# Altium project 核心板.PrjPcb
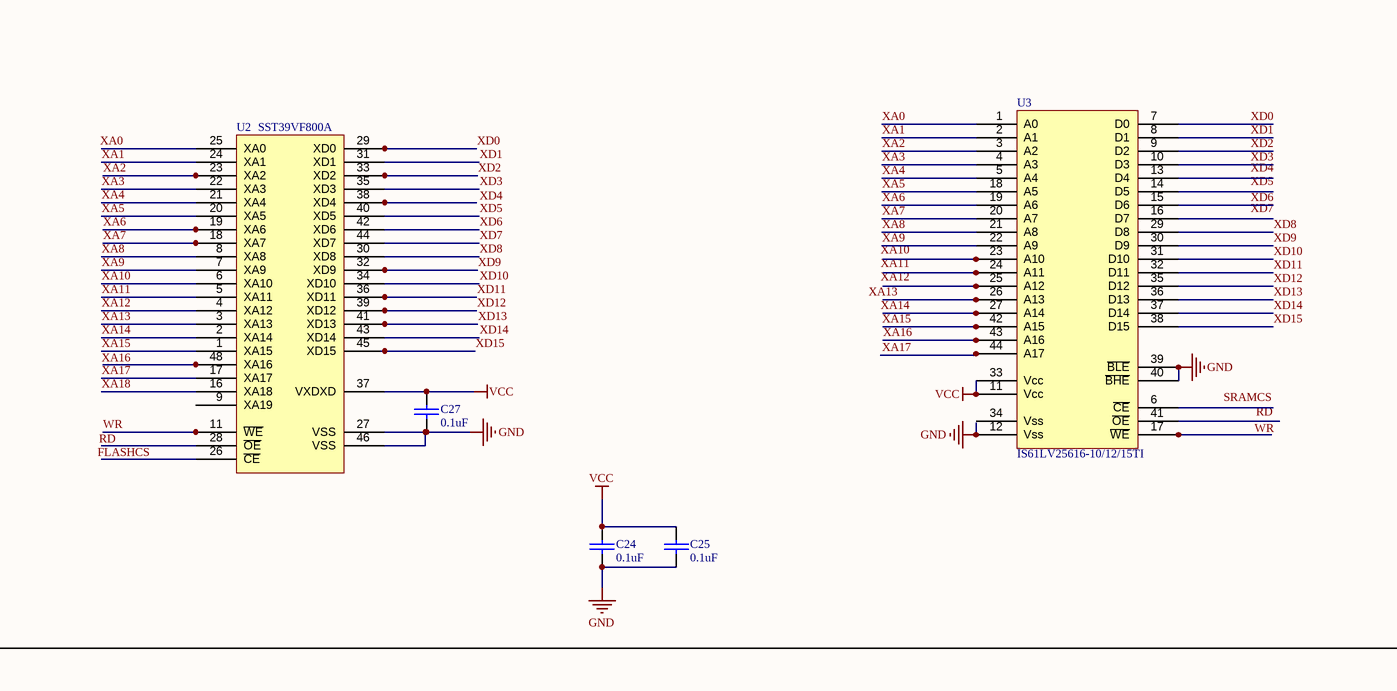
[diagram p0: 核心板原理图.SchDoc, top left]
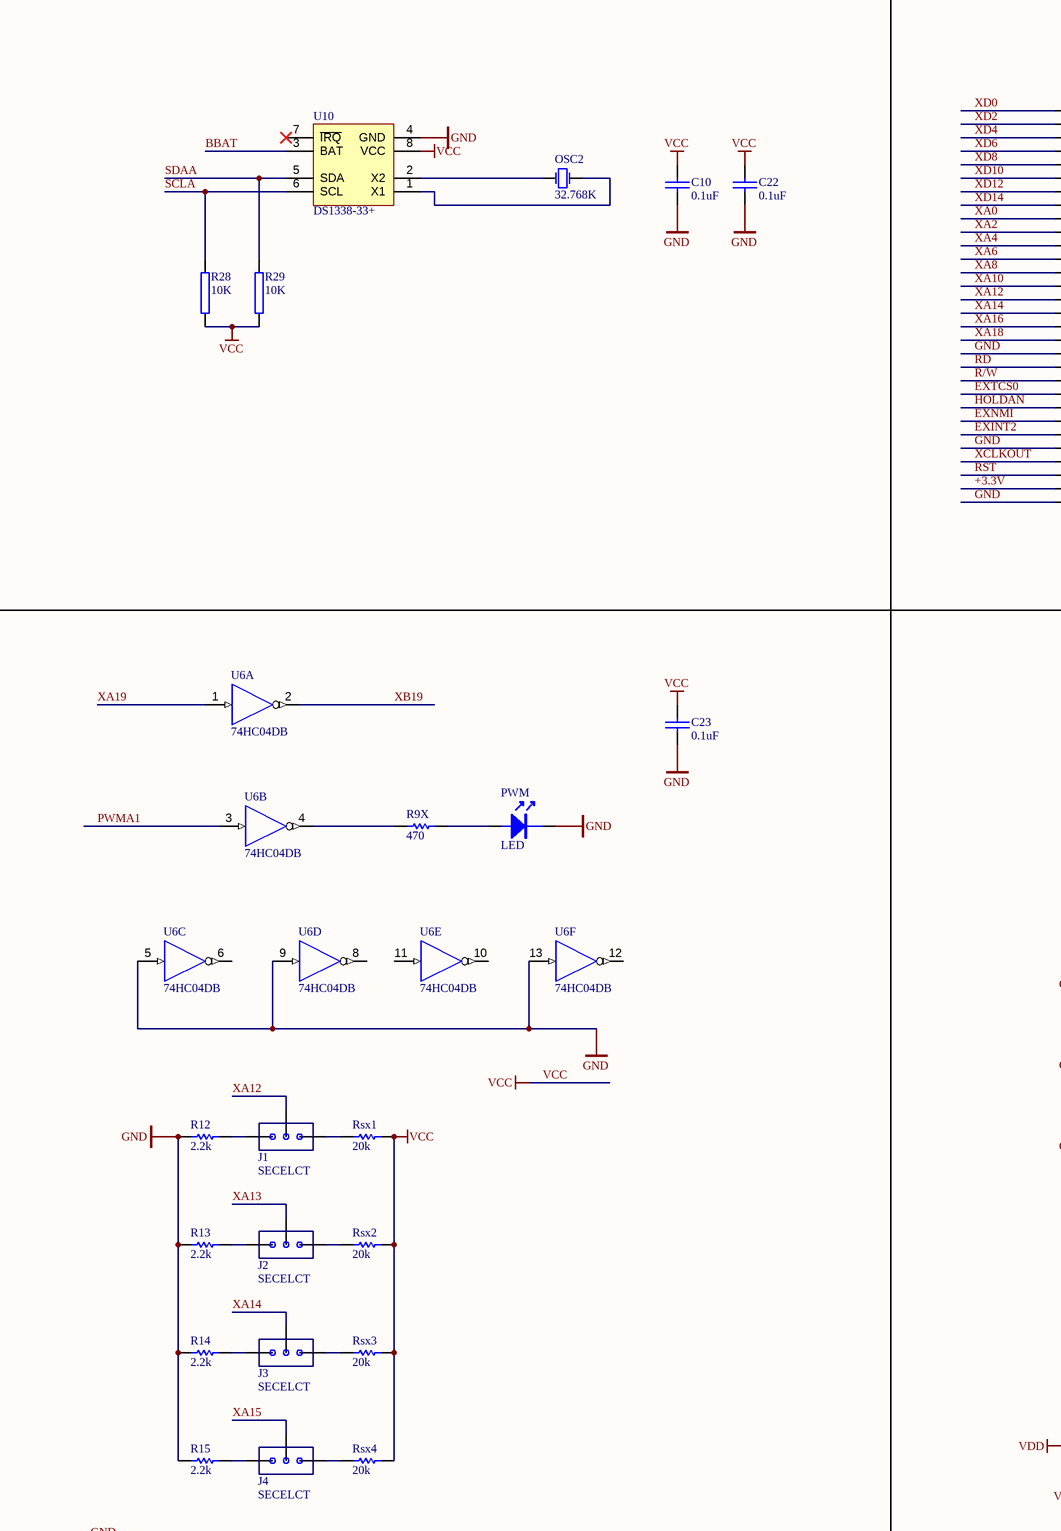
[diagram p1: 核心板原理图.SchDoc, top middle]
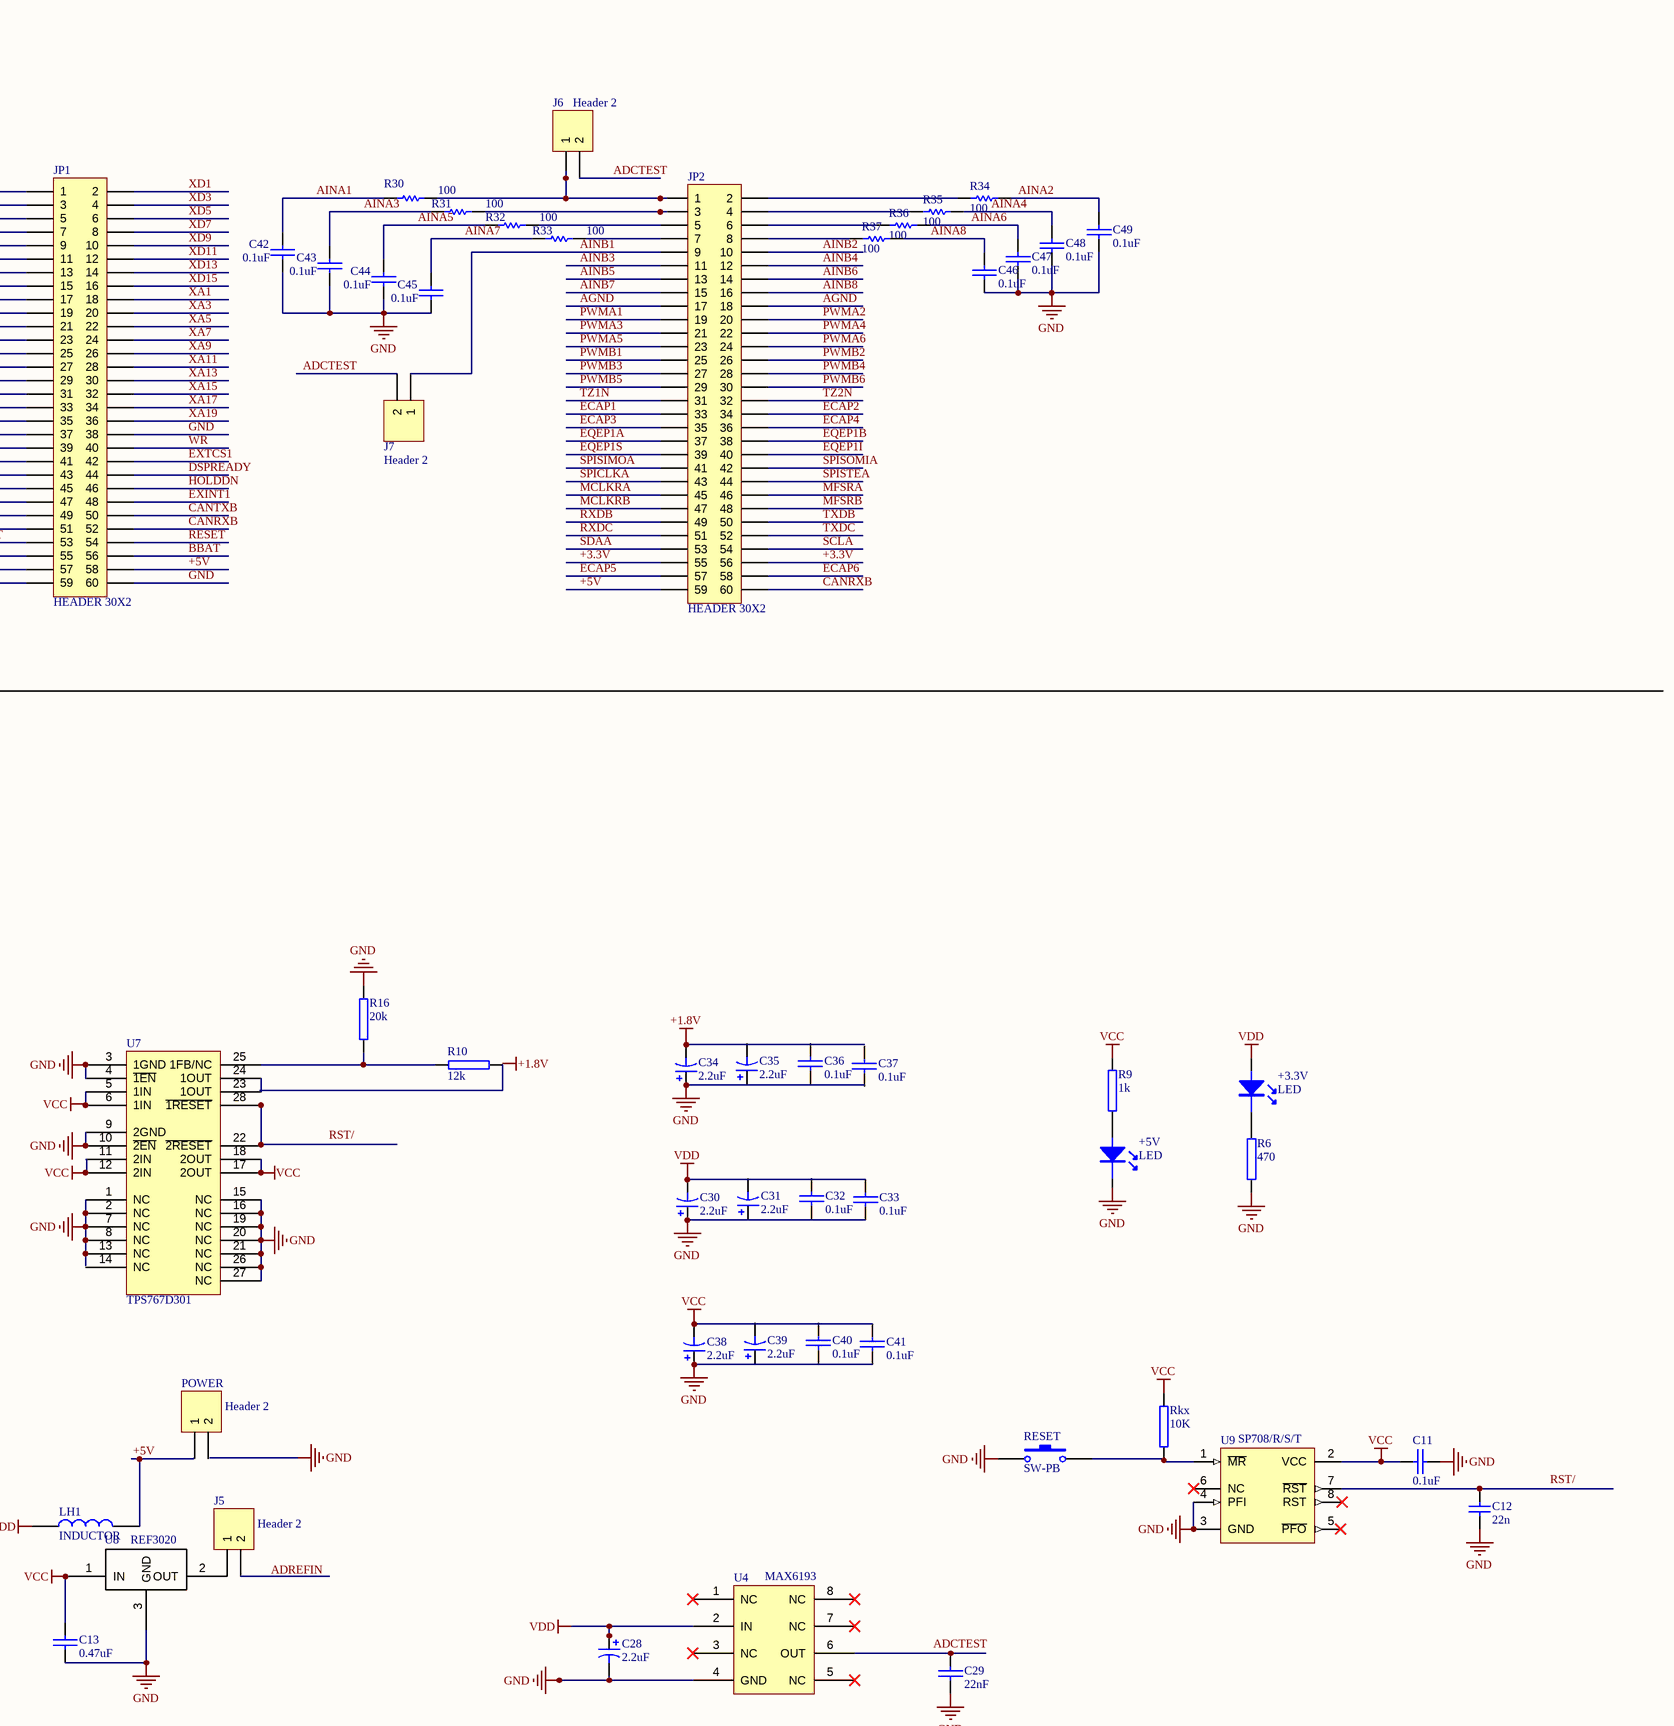
[diagram p2: 核心板原理图.SchDoc, top right]
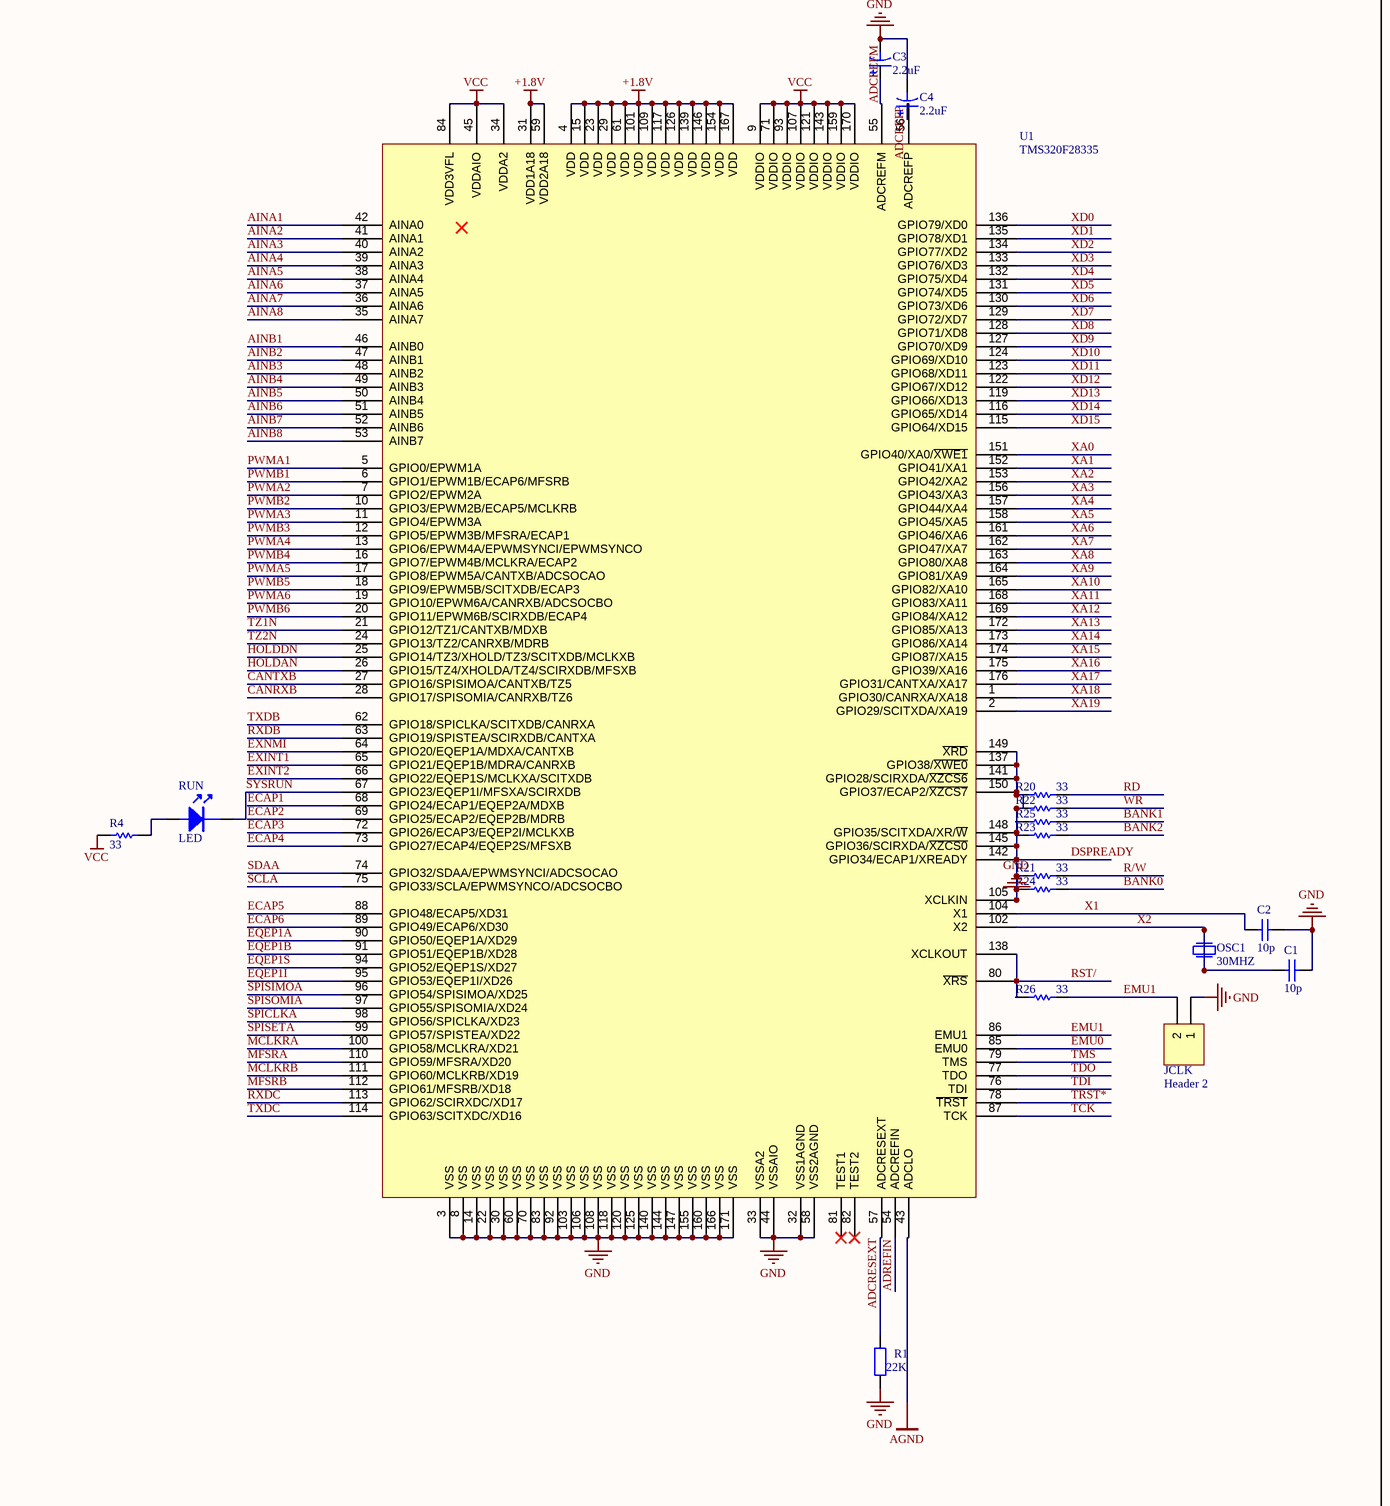
[diagram p3: 核心板原理图.SchDoc, bottom left]
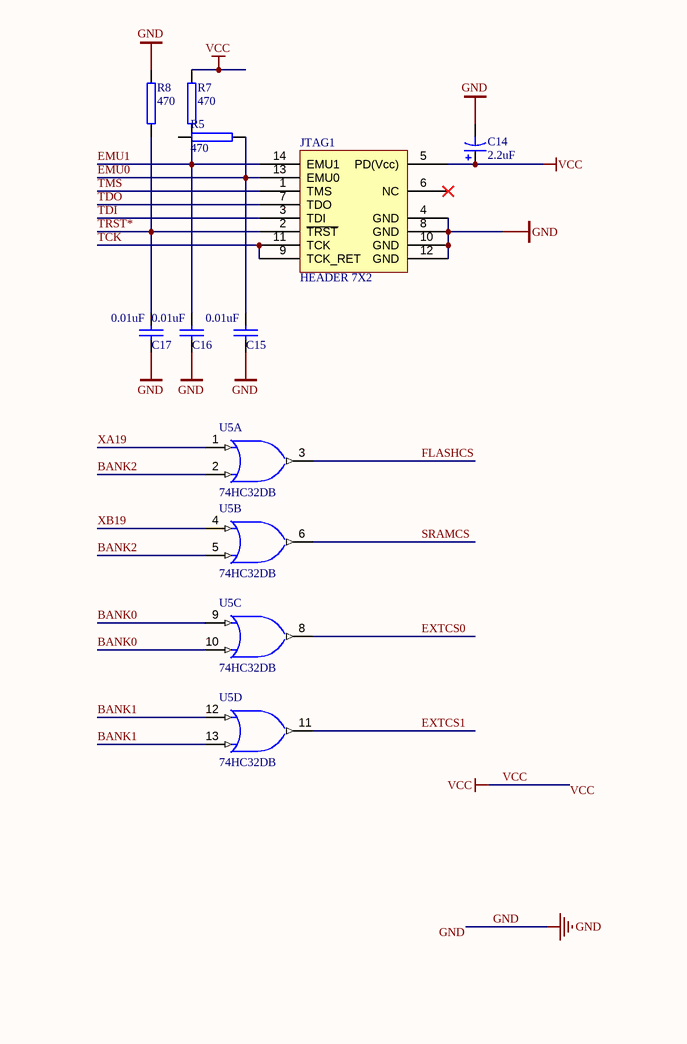
[diagram p4: 核心板原理图.SchDoc, bottom middle]
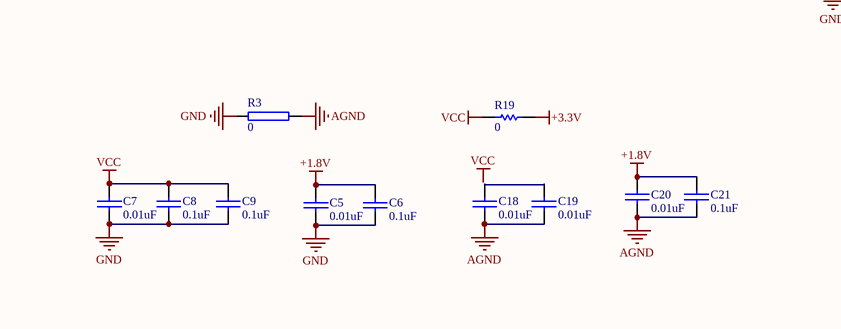
[diagram p5: 核心板原理图.SchDoc, bottom right]
1 sheet, 116 parts. Net scope: global (net labels, ports and power ports of the same name join across sheets).
Board file: 新核心板PCB.PcbDoc

## Sheet 核心板原理图.SchDoc
size OrCAD D; SheetNumber: 1; SheetTotal: 1

### Parts
+3.3V  LED  [1N60P]
+5V  LED  [1N60P]
C1  value 10p  [C0603L]  (hidden comment: C10p-0603)
C2  value 10p  [C0603L]  (hidden comment: C10p-0603)
C3  2.2uF  [0805]
C4  2.2uF  [0805]
C5  0.01uF  [0805]
C6  0.1uF  [0805]
C7  0.01uF  [0805]
C8  0.1uF  [0805]
C9  0.1uF  [0805]
C10  0.1uF  [0805]
C11  0.1uF  [0805]
C12  value 22n  [C0603L]  (hidden comment: C22n-0603)
C13  0.47uF  [0805]
C14  2.2uF  [0805]
C15  0.01uF  [0805]
C16  0.01uF  [0805]
C17  0.01uF  [0805]
C18  0.01uF  [0805]
C19  0.01uF  [0805]
C20  0.01uF  [0805]
C21  0.1uF  [0805]
C22  0.1uF  [0805]
C23  0.1uF  [0805]
C24  0.1uF  [0805]
C25  0.1uF  [0805]
C27  0.1uF  [0805]
C28  2.2uF  [0805]
C29  22nF  [0805]
C30  2.2uF  [0805]
C31  2.2uF  [0805]
C32  0.1uF  [0805]
C33  0.1uF  [0805]
C34  2.2uF  [0805]
C35  2.2uF  [0805]
C36  0.1uF  [0805]
C37  0.1uF  [0805]
C38  2.2uF  [0805]
C39  2.2uF  [0805]
C40  0.1uF  [0805]
C41  0.1uF  [0805]
C42  0.1uF  [0805]
C43  0.1uF  [0805]
C44  0.1uF  [0805]
C45  0.1uF  [0805]
C46  0.1uF  [0805]
C47  0.1uF  [0805]
C48  0.1uF  [0805]
C49  0.1uF  [0805]
J1  SECELCT  [TTIP3]
J2  SECELCT  [TTIP3]
J3  SECELCT  [TTIP3]
J4  SECELCT  [TTIP3]
J5  Header 2  [TTIP2]
J6  Header 2  [TTIP2]
J7  Header 2  [TTIP2]
JCLK  Header 2  [TTIP2]
JP1  HEADER 30X2  [TTIP30X2]
JP2  HEADER 30X2  [TTIP30X2]
JTAG1  HEADER 7X2  [IDC14-A-JATG]
LH1  INDUCTOR  [3216]
OSC1  30MHZ  [XTAL1]
OSC2  value 32.768K  [XTAL-DIP2S3*8]  (hidden comment: CR32K-DT38-12-DIP)
POWER  Header 2  [TTIP2]
PWM  LED  [1N60P]
R1  value 22K  [R0603L]  (hidden comment: R22K-0603)
R3  0  [0805]
R4  value 33  [0805]  (hidden comment: Res1)
R5  470  [0805]
R6  470  [0805]
R7  470  [0805]
R8  470  [0805]
R9  1k  [0805]
R9X  value 470  [0805]  (hidden comment: Res1)
R10  12k  [0805]
R12  value 2.2k  [0805]  (hidden comment: Res1)
R13  value 2.2k  [0805]  (hidden comment: Res1)
R14  value 2.2k  [0805]  (hidden comment: Res1)
R15  value 2.2k  [0805]  (hidden comment: Res1)
R16  20k  [0805]
R19  value 0  [0805]  (hidden comment: Res1)
R20  value 33  [0805]  (hidden comment: Res1)
R21  value 33  [0805]  (hidden comment: Res1)
R22  value 33  [0805]  (hidden comment: Res1)
R23  value 33  [0805]  (hidden comment: Res1)
R24  value 33  [0805]  (hidden comment: Res1)
R25  value 33  [0805]  (hidden comment: Res1)
R26  value 33  [0805]  (hidden comment: Res1)
R28  10K  [0805]
R29  10K  [0805]
R30  value 100  [0805]  (hidden comment: Res1)
R31  value 100  [0805]  (hidden comment: Res1)
R32  value 100  [0805]  (hidden comment: Res1)
R33  value 100  [0805]  (hidden comment: Res1)
R34  value 100  [0805]  (hidden comment: Res1)
R35  value 100  [0805]  (hidden comment: Res1)
R36  value 100  [0805]  (hidden comment: Res1)
R37  value 100  [0805]  (hidden comment: Res1)
RESET  SW-PB  [KEY2]
Rkx  10K  [0805]
Rsx1  value 20k  [0805]  (hidden comment: Res1)
Rsx2  value 20k  [0805]  (hidden comment: Res1)
Rsx3  value 20k  [0805]  (hidden comment: Res1)
Rsx4  value 20k  [0805]  (hidden comment: Res1)
RUN  LED  [1N60P]
U1  TMS320F28335  [LQFP-176]
U2  SST39VF800A  [TSOP48]
U3  IS61LV25616-10/12/15TI  [TSOP II Z44]
U4  MAX6193  [SO-8]
U5  74HC32DB  [SSOP14]  (parts A,B,C,D of 4)
U6  74HC04DB  [SSOP14]  (parts A,B,C,D,E,F of 6)
U7  TPS767D301  [TSOP-28]
U8  REF3020  [X3-1]
U9  SP708/R/S/T  [SOIC-8]
U10  DS1338-33+  [SO-08]

### Nets
+1.8V: C5.1 C6.1 C20.1 C21.1 U1.4(VDD) U1.15(VDD) U1.23(VDD) U1.29(VDD) U1.31(VDD1A18) U1.59(VDD2A18) U1.61(VDD) U1.101(VDD) U1.109(VDD) U1.117(VDD) U1.126(VDD) U1.139(VDD) U1.146(VDD) U1.154(VDD) U1.167(VDD)
+3.3V: JP1.57 JP2.55 JP2.56 R19.2
AGND: C18.2 C19.2 C20.2 C21.2 JP2.17 JP2.18 R3.2 U1.43(ADCLO)
DSPREADY: C1.1 C2.1 C3.2 C4.2 C5.2 C6.2 C7.2 C8.2 C9.2 C10.2 C11.2 C12.1 C13.2 C14.2 C15.2 C16.2 C17.2 C22.2 C23.2 C24.2 C25.2 C27.2 C28.2 C29.2 C30.1 C33.2 C34.1 C38.1 C41.2 C42.2 C43.2 C44.2 C45.2 C46.1 C47.1 C48.1 C49.1 JCLK.1 JP1.37 JP1.38 JP1.44 JP1.51 JP1.59 JP1.60 JTAG1.4(GND) JTAG1.8(GND) JTAG1.10(GND) JTAG1.12(GND) PWM.K R1.2 R6.1 R8.2 R12.1 R13.1 R14.1 R15.1 R16.1 R20.1 R21.1 R22.1 R24.1 RESET.1 U1.3(VSS) U1.8(VSS) U1.14(VSS) U1.22(VSS) U1.30(VSS) U1.32(VSS1AGND) U1.33(VSSA2) U1.44(VSSAIO) U1.58(VSS2AGND) U1.60(VSS) U1.70(VSS) U1.83(VSS) U1.92(VSS) U1.103(VSS) U1.105(XCLKIN) U1.106(VSS) U1.108(VSS) U1.118(VSS) U1.120(VSS) U1.125(VSS) U1.137(GPIO38/~{XWE0}) U1.140(VSS) U1.141(GPIO28/SCIRXDA/~{XZCS6}) U1.142(GPIO34/ECAP1/XREADY) U1.144(VSS) U1.145(GPIO36/SCIRXDA/~{XZCS0}) U1.147(VSS) U1.148(GPIO35/SCITXDA/XR/~{W}) U1.149(~{XRD}) U1.150(GPIO37/ECAP2/~{XZCS7}) U1.155(VSS) U1.160(VSS) U1.166(VSS) U1.171(VSS) U2.27(VSS) U2.46(VSS) U3.12(Vss) U3.39(~{BLE}) U3.40(~{BHE}) U4.4(GND) U6.5(3A) U6.9(4A) U6.13(6A) U7.1(NC) U7.2(NC) U7.3(1GND) U7.4(~{1EN}) U7.7(NC) U7.8(NC) U7.9(2GND) U7.10(~{2EN}) U7.13(NC) U7.15(NC) U7.16(NC) U7.19(NC) U7.20(NC) U7.21(NC) U7.26(NC) U7.27(NC) U8.3(GND) U9.3(GND) U9.4(PFI) U10.4(GND)  [also labelled GND]
VCC: C7.1 C8.1 C9.1 C10.1 C11.1 C13.1 C14.1 C22.1 C23.1 C24.1 C25.1 C27.1 JTAG1.5(PD(Vcc)) R4.1 R7.2 R19.1 R28.1 R29.1 Rkx.1 Rsx1.2 Rsx2.2 Rsx3.2 Rsx4.2 U1.9(VDDIO) U1.34(VDDA2) U1.45(VDDAIO) U1.71(VDDIO) U1.84(VDD3VFL) U1.93(VDDIO) U1.107(VDDIO) U1.121(VDDIO) U1.143(VDDIO) U1.159(VDDIO) U1.170(VDDIO) U2.37(VXDXD) U3.11(Vcc) U3.33(Vcc) U7.11(2IN) U7.12(2IN) U7.17(2OUT) U7.18(2OUT) U8.1(IN) U9.2(VCC) U10.8(VCC)
VDD: +3.3V.A C28.1 LH1.1 U4.2(IN)
+5V: JP1.58 JP2.59 LH1.2
ADCREFM: C3.1 U1.55(ADCREFM)
ADCRESEXT: R1.1 U1.57(ADCRESEXT)
ADCTEST: J6.2 J7.2
ADREFIN: U1.54(ADCREFIN)
AINA1: C42.1 R30.1 U1.42(AINA0)
AINA2: C49.2 R34.1 U1.41(AINA1)
AINA3: C43.1 R31.1 U1.40(AINA2)
AINA4: C48.2 R35.1 U1.39(AINA3)
AINA5: C44.1 R32.1 U1.38(AINA4)
AINA6: C47.2 R36.1 U1.37(AINA5)
AINA7: C45.1 R33.1 U1.36(AINA6)
AINA8: C46.2 R37.1 U1.35(AINA7)
AINB1: J7.1 JP2.9 U1.46(AINB0)
AINB2: JP2.10 U1.47(AINB1)
AINB3: JP2.11 U1.48(AINB2)
AINB4: JP2.12 U1.49(AINB3)
AINB5: JP2.13 U1.50(AINB4)
AINB6: JP2.14 U1.51(AINB5)
AINB7: JP2.15 U1.52(AINB6)
AINB8: JP2.16 U1.53(AINB7)
BANK0: R24.2 U5.9(3A) U5.10(3B)
BANK1: R25.2 U5.12(4A) U5.13(4B)
BANK2: R23.2 U5.2(1B) U5.5(2B)
BBAT: JP1.56 U10.3(BAT)
CANRXB: JP1.52 JP2.60 U1.28(GPIO17/SPISOMIA/CANRXB/TZ6)
CANTXB: JP1.50 U1.27(GPIO16/SPISIMOA/CANTXB/TZ5)
ECAP1: JP2.33 U1.68(GPIO24/ECAP1/EQEP2A/MDXB)
ECAP2: JP2.34 U1.69(GPIO25/ECAP2/EQEP2B/MDRB)
ECAP3: JP2.35 U1.72(GPIO26/ECAP3/EQEP2I/MCLKXB)
ECAP4: JP2.36 U1.73(GPIO27/ECAP4/EQEP2S/MFSXB)
ECAP5: JP2.57 U1.88(GPIO48/ECAP5/XD31)
ECAP6: JP2.58 U1.89(GPIO49/ECAP6/XD30)
EMU0: C15.1 JTAG1.13(EMU0) R5.1 U1.85(EMU0)
EMU1: C16.1 JCLK.2 JTAG1.14(EMU1) R7.1 R26.2 U1.86(EMU1)
EQEP1A: JP2.37 U1.90(GPIO50/EQEP1A/XD29)
EQEP1B: JP2.38 U1.91(GPIO51/EQEP1B/XD28)
EQEP1I: JP2.40 U1.95(GPIO53/EQEP1I/XD26)
EQEP1S: JP2.39 U1.94(GPIO52/EQEP1S/XD27)
EXINT1: JP1.48 U1.65(GPIO21/EQEP1B/MDRA/CANRXB)
EXINT2: JP1.49 U1.66(GPIO22/EQEP1S/MCLKXA/SCITXDB)
EXNMI: JP1.47 U1.64(GPIO20/EQEP1A/MDXA/CANTXB)
EXTCS0: JP1.43 U5.8(3Y)
EXTCS1: JP1.42 U5.11(4Y)
FLASHCS: U5.3(1Y)
HOLDAN: JP1.45 U1.26(GPIO15/TZ4/XHOLDA/TZ4/SCIRXDB/MFSXB)
HOLDDN: JP1.46 U1.25(GPIO14/TZ3/XHOLD/TZ3/SCITXDB/MCLKXB)
MCLKRA: JP2.45 U1.100(GPIO58/MCLKRA/XD21)
MCLKRB: JP2.47 U1.111(GPIO60/MCLKRB/XD19)
MFSRA: JP2.46 U1.110(GPIO59/MFSRA/XD20)
MFSRB: JP2.48 U1.112(GPIO61/MFSRB/XD18)
PWMA1: JP2.19 U1.5(GPIO0/EPWM1A) U6.3(2A)
PWMA2: JP2.20 U1.7(GPIO2/EPWM2A)
PWMA3: JP2.21 U1.11(GPIO4/EPWM3A)
PWMA4: JP2.22 U1.13(GPIO6/EPWM4A/EPWMSYNCI/EPWMSYNCO)
PWMA5: JP2.23 U1.17(GPIO8/EPWM5A/CANTXB/ADCSOCAO)
PWMA6: JP2.24 U1.19(GPIO10/EPWM6A/CANRXB/ADCSOCBO)
PWMB1: JP2.25 U1.6(GPIO1/EPWM1B/ECAP6/MFSRB)
PWMB2: JP2.26 U1.10(GPIO3/EPWM2B/ECAP5/MCLKRB)
PWMB3: JP2.27 U1.12(GPIO5/EPWM3B/MFSRA/ECAP1)
PWMB4: JP2.28 U1.16(GPIO7/EPWM4B/MCLKRA/ECAP2)
PWMB5: JP2.29 U1.18(GPIO9/EPWM5B/SCITXDB/ECAP3)
PWMB6: JP2.30 U1.20(GPIO11/EPWM6B/SCIRXDB/ECAP4)
R/W: JP1.41 R21.2
RD: JP1.39 R20.2
RESET: JP1.54
RST: JP1.55
RST/: R26.1 U1.80(~{XRS}) U1.138(XCLKOUT)
RXDB: JP2.49 U1.63(GPIO19/SPISTEA/SCIRXDB/CANTXA)
RXDC: JP2.51 U1.113(GPIO62/SCIRXDC/XD17)
SCLA: JP2.54 R28.2 U1.75(GPIO33/SCLA/EPWMSYNCO/ADCSOCBO) U10.6(SCL)
SDAA: JP2.53 R29.2 U1.74(GPIO32/SDAA/EPWMSYNCI/ADCSOCAO) U10.5(SDA)
SPICLKA: JP2.43 U1.98(GPIO56/SPICLKA/XD23)
SPISETA: U1.99(GPIO57/SPISTEA/XD22)
SPISIMOA: JP2.41 U1.96(GPIO54/SPISIMOA/XD25)
SPISOMIA: JP2.42 U1.97(GPIO55/SPISOMIA/XD24)
SPISTEA: JP2.44
SRAMCS: U5.6(2Y)
SYSRUN: RUN.K U1.67(GPIO23/EQEP1I/MFSXA/SCIRXDB)
TCK: JTAG1.9(TCK_RET) JTAG1.11(TCK) U1.87(TCK)
TDI: JTAG1.3(TDI) U1.76(TDI)
TDO: JTAG1.7(TDO) U1.77(TDO)
TMS: JTAG1.1(TMS) U1.79(TMS)
TRST*: C17.1 JTAG1.2(~{TRST}) R8.1 U1.78(~{TRST})
TXDB: JP2.50 U1.62(GPIO18/SPICLKA/SCITXDB/CANRXA)
TXDC: JP2.52 U1.114(GPIO63/SCITXDC/XD16)
TZ1N: JP2.31 U1.21(GPIO12/TZ1/CANTXB/MDXB)
TZ2N: JP2.32 U1.24(GPIO13/TZ2/CANRXB/MDRB)
WR: JP1.40 R22.2 U2.11(~{WE})
X1: C2.2 U1.104(X1)
X2: C1.2 OSC1.1(P1) OSC1.2(P2) U1.102(X2)
XA0: JP1.17 U1.151(GPIO40/XA0/~{XWE1}) U3.1(A0)
XA1: JP1.18 U1.152(GPIO41/XA1) U2.24(XA1) U3.2(A1)
XA2: JP1.19 U1.153(GPIO42/XA2) U2.23(XA2) U3.3(A2)
XA3: JP1.20 U1.156(GPIO43/XA3) U2.22(XA3) U3.4(A3)
XA4: JP1.21 U1.157(GPIO44/XA4) U2.21(XA4) U3.5(A4)
XA5: JP1.22 U1.158(GPIO45/XA5) U2.20(XA5) U3.18(A5)
XA6: JP1.23 U1.161(GPIO46/XA6) U2.19(XA6) U3.19(A6)
XA7: JP1.24 U1.162(GPIO47/XA7) U2.18(XA7) U3.20(A7)
XA8: JP1.25 U1.163(GPIO80/XA8) U2.8(XA8) U3.21(A8)
XA9: JP1.26 U1.164(GPIO81/XA9) U2.7(XA9) U3.22(A9)
XA10: JP1.27 U1.165(GPIO82/XA10) U2.6(XA10)
XA11: JP1.28 U1.168(GPIO83/XA11) U2.5(XA11)
XA12: J1.2 JP1.29 U1.169(GPIO84/XA12) U2.4(XA12)
XA13: J2.2 JP1.30 U1.172(GPIO85/XA13) U2.3(XA13)
XA14: J3.2 JP1.31 U1.173(GPIO86/XA14) U2.2(XA14)
XA15: J4.2 JP1.32 U1.174(GPIO87/XA15) U2.1(XA15)
XA16: JP1.33 U1.175(GPIO39/XA16) U3.43(A16)
XA17: JP1.34 U1.176(GPIO31/CANTXA/XA17) U2.17(XA17) U3.44(A17)
XA18: JP1.35 U1.1(GPIO30/CANRXA/XA18) U2.16(XA18)
XA19: JP1.36 U1.2(GPIO29/SCITXDA/XA19) U5.1(1A) U6.1(1A)
XB19: U5.4(2A) U6.2(1~{Y})
XCLKOUT: JP1.53
XD0: JP1.1 U1.136(GPIO79/XD0) U2.29(XD0) U3.7(D0)
XD1: JP1.2 U1.135(GPIO78/XD1) U2.31(XD1) U3.8(D1)
XD2: JP1.3 U1.134(GPIO77/XD2) U2.33(XD2) U3.9(D2)
XD3: JP1.4 U1.133(GPIO76/XD3) U2.35(XD3) U3.10(D3)
XD4: JP1.5 U1.132(GPIO75/XD4)
XD5: JP1.6 U1.131(GPIO74/XD5) U2.40(XD5)
XD6: JP1.7 U1.130(GPIO73/XD6) U2.42(XD6) U3.15(D6)
XD7: JP1.8 U1.129(GPIO72/XD7) U2.44(XD7)
XD8: JP1.9 U1.128(GPIO71/XD8) U2.30(XD8) U3.29(D8)
XD9: JP1.10 U1.127(GPIO70/XD9) U2.32(XD9) U3.30(D9)
XD10: JP1.11 U1.124(GPIO69/XD10) U2.34(XD10) U3.31(D10)
XD11: JP1.12 U1.123(GPIO68/XD11) U2.36(XD11) U3.32(D11)
XD12: JP1.13 U1.122(GPIO67/XD12) U2.39(XD12) U3.35(D12)
XD13: JP1.14 U1.119(GPIO66/XD13) U2.41(XD13) U3.36(D13)
XD14: JP1.15 U1.116(GPIO65/XD14) U2.43(XD14) U3.37(D14)
XD15: JP1.16 U1.115(GPIO64/XD15) U2.45(XD15) U3.38(D15)
Net+3.3V_K: +3.3V.K R6.2
Net+5V_A: +5V.A R9.2
NetC4_1: C4.1 U1.56(ADCREFP)
NetC12_2: C12.2 U9.7(~{RST})
NetC18_1: C18.1 C19.1
NetC29_1: C29.1 U4.6(OUT)
NetC30_2: C30.2 C33.1
NetC38_2: C38.2 C41.1
NetJ1_1: J1.1 R12.2
NetJ1_3: J1.3 Rsx1.1
NetJ2_1: J2.1 R13.2
NetJ2_3: J2.3 Rsx2.1
NetJ3_1: J3.1 R14.2
NetJ3_3: J3.3 Rsx3.1
NetJ4_1: J4.1 R15.2
NetJ4_3: J4.3 Rsx4.1
NetJ5_1: J5.1 U8.2(OUT)
NetJ6_1: J6.1 JP2.1 R30.2
NetJP2_2: JP2.2 R34.2
NetJP2_3: JP2.3 R31.2
NetJP2_4: JP2.4 R35.2
NetJP2_5: JP2.5 R32.2
NetJP2_6: JP2.6 R36.2
NetJP2_7: JP2.7 R33.2
NetJP2_8: JP2.8 R37.2
NetOSC2_1: OSC2.1(OSC1) U10.2(X2)
NetOSC2_2: OSC2.2(OSC2) U10.1(X1)
NetPWM_A: PWM.A R9X.2
NetR4_2: R4.2 RUN.A
NetR9X_1: R9X.1 U6.4(2~{Y})
NetR10_2: R10.2 R16.2 U7.25(1FB/NC)
NetRESET_2: RESET.2 Rkx.2 U9.1(~{MR})
NetU7_5: U7.5(1IN) U7.6(1IN)
NetU7_22: U7.22(~{2RESET}) U7.28(~{1RESET})
NetU7_23: U7.23(1OUT) U7.24(1OUT)

Not connected (* = marked no-connect by the designer): +5V K; C31 1 2; C32 1 2; C34 2; C35 1 2; C36 1 2; C37 1 2; C39 1 2; C40 1 2; J5 2; JTAG1 6(NC)*; POWER 1 2; R3 1; R5 2; R9 1; R10 1; R23 1; R25 1; U1 81(TEST1)* 82(TEST2)*; U2 9(XA19) 25(XA0) 26(~{CE}) 28(~{OE}) 38(XD4) 48(XA16); U3 6(~{CE}) 13(D4) 14(D5) 16(D7) 17(~{WE}) 23(A10) 24(A11) 25(A12) 26(A13) 27(A14) 34(Vss) 41(~{OE}) 42(A15); U4 1(NC)* 3(NC)* 5(NC)* 7(NC)* 8(NC)*; U5 7(GND) 14(VCC); U6 6(3~{Y}) 7(GND) 8(4~{Y}) 10(5~{Y}) 11(5A) 12(6~{Y}) 14(VCC); U7 14(NC); U9 5(~{PFO}) 6(NC)* 8(RST)*; U10 7(~{IRQ})*

### Notes on the sheet
- Labels drawn without touching a wire or pin: +1.8V, ADCREFP, ADCTEST, ADREFIN, FLASHCS, GND, RD, RST/, SRAMCS, VCC, VDD, WR, XA0, XA10, XA11, XA12, XA13, XA14, XA15, XA16, XD4, XD5, XD7
- DWG NO:
- REV:
- THIS DOCUMENT AND THE DATA DISCLOSED HEREIN OR
- HEREWITH IS THE PROPERTY OF ALTIUM LIMITED AND MAY
- BE FREELY DISTRIBUTED IN WHOLE. NO RIGHTS ARE
- RESERVED OR EXPRESS OR IMPLIED WARANTEE GIVEN.
- REVISION
- DESCRIPTION
- DATE
- APPROVED
- ENG:
- APPROVALS
- PROJECT
- DSN:
- CHK:
- REFERENCE DOCUMENTS
- PROJECT REVISION:
- TITLE
- DOCUMENT REVISION:
- DESIGN ITEM:
- BOM:
- FAB DWG:
- PCB DWG:
- ASSY DWG:
- SCALE:
- A2
- SIZE
- CAGE CODE
- FILE NAME
- DWG NO.
- SHEET
- OF
- REV

### Library data of the parts
C1 C2 = C10p-0603: Pb-free,0603,10pF,NPO,±5%,50V,-55℃～125℃,N（三层电镀端头）,带装; Part Number: 3DZ0040010; specification: Pb-free,0603,10pF,NPO,±5%,50V,-55℃～125℃,N（三层电镀端头）,带装
C3 C4 C14 C28 C30 C31 C34 C35 C38 C39 = Cap Pol3: Polarized Capacitor (Surface Mount); Value: 0.1uF/50V/X7R; Published: 8-Jun-2000; LatestRevisionDate: 29-May-2009; LatestRevisionNote: IPC-7351 Footprint Added.; PackageReference: C0805; Publisher: Altium Limited; PackageDescription: Chip Capacitor
C5-C11 C13 C18-C25 C27 C29 C32 C33 C36 C37 C40-C49 = CAP: Capacitor
C12 = C22n-0603: Pb-free,0603,22nF,X7R,±10%,50V,-55℃～125℃,N（三层电镀端头）,带装; Part Number: 3DZ0040018; specification: Pb-free,0603,22nF,X7R,±10%,50V,-55℃～125℃,N（三层电镀端头）,带装
C15-C17 = C
J5-J7 JCLK POWER = Header 2: Header, 2-Pin; LatestRevisionDate: 17-Jul-2002; LatestRevisionNote: Re-released for DXP Platform.; Publisher: Altium Limited
JP1 JP2 = Header 30X2: Header, 30-Pin, Dual row; LatestRevisionDate: 17-Jul-2002; LatestRevisionNote: Re-released for DXP Platform.; Publisher: Altium Limited
JTAG1 = JTAG-1
OSC1 = 30MHZ: Crystal Oscillator
OSC2 = CR32K-DT38-12-DIP: Pb-free,直插晶体谐振器,DT38G-C12Q-32.768KHz,32.768KHz,12.5pF,±20ppm,DT38（3*8mm）,-40°C~+85°C; Part Number: 3DZ0070001; Specification: Pb-free,直插晶体谐振器,DT38G-C12Q-32.768KHz,32.768KHz,12.5pF,±20ppm,DT38（3*8mm）,-40°C~+85°C
R1 = R22K-0603: Pb-free,0603,22kΩ,1%,1/16w,±200PPM,50V,-55℃～155℃; Part Number: 3DZ0030038; specification: Pb-free,0603,22kΩ,1%,1/16w,±200PPM,50V,-55℃～155℃
R3 R5-R10 R16 R28 R29 Rkx = R
R4 R9X R12-R15 R19-R26 R30-R37 Rsx1-Rsx4 = Res1: Resistor; Published: 8-Jun-2000; LatestRevisionDate: 17-Jul-2002; LatestRevisionNote: Re-released for DXP Platform.; PackageReference: AXIAL-0.3; Publisher: Altium Limited
RESET = SW-PB: Switch; Published: 24-Mar-1999; LatestRevisionDate: 17-Jul-2002; LatestRevisionNote: Re-released for DXP Platform.; PackageReference: SPST-2; Publisher: Altium Limited
U2 = SST39VF800
U3 = CY7C1041
U5 = HD74HC32FP: Quad 2-Input OR Gates; Published: 10-Feb-2010; DatasheetVersion: Rev.2.00, Oct-2005; PackageVersion: Sep-2005; PackageReference: PRSP0014DF-B; Publisher: Altium Limited; PackageDescription: 14-Pin Plastic Small Outline Package, 10.06 x 5.5 mm Body, 1.27 mm Pitch; Code_JEITA: P-SOP14-5.5x10.06-1.27; ComponentLink1Description: Manufacturer Link; ComponentLink1URL: http://sg.renesas.com/fmwk.jsp?cnt=hd74hc_root.jsp&fp=/products/standard_ic/general_purpose_logic/5v_standard_logic/hd74hc/; ComponentLink2Description: Datasheet; ComponentLink2URL: http://documentation.renesas.com/eng/products/logic/rej03d0545_hd74hc32ds.pdf; ComponentLink3Description: Packaging Specification; ComponentLink3URL: http://sg.renesas.com/media/products/common_info/package/pdf/ic/code/prsp0014df_b.pdf
U6 = HD74HC04FP: Hex Inverters; Published: 10-Feb-2010; DatasheetVersion: Rev.2.00, Oct-2005; PackageVersion: Sep-2005; PackageReference: PRSP0014DF-B; Publisher: Altium Limited; PackageDescription: 14-Pin Plastic Small Outline Package, 10.06 x 5.5 mm Body, 1.27 mm Pitch; Code_JEITA: P-SOP14-5.5x10.06-1.27; ComponentLink1Description: Manufacturer Link; ComponentLink1URL: http://sg.renesas.com/fmwk.jsp?cnt=hd74hc_root.jsp&fp=/products/standard_ic/general_purpose_logic/5v_standard_logic/hd74hc/; ComponentLink2Description: Datasheet; ComponentLink2URL: http://documentation.renesas.com/eng/products/logic/rej03d0534_hd74hc04ds.pdf; ComponentLink3Description: Packaging Specification; ComponentLink3URL: http://sg.renesas.com/media/products/common_info/package/pdf/ic/code/prsp0014df_b.pdf
U7 = TPS767D301_1
U9 = MAX708TCSA: +3V Voltage Monitoring, Low-Cost, 礟 Supervisory Circuit; Published: 16-Jan-2001; LatestRevisionDate: 13-Apr-2006; LatestRevisionNote: IPC-7351 Footprint Added.; DatasheetVersion: Sep-1995; PackageReference: NSO8; Publisher: Altium Limited; PackageDescription: 8-Pin Small Outline Integrated Circuit 1.27 mm Pitch; Code_JEDEC: MS-012-AA; Code_IPC: SOIC127P600-8; ComponentLink1Description: Manufacturer Link; ComponentLink1URL: http://www.maxim-ic.com/; ComponentLink2Description: Datasheet; ComponentLink2URL: http://pdfserv.maxim-ic.com/en/ds/MAX706P-MAX708T.pdf
U10 = X1205